# EAGLE design Mainboard (EAGLE 7.7.0)

## Sheet 1 of 5

## Sheet 2 of 5
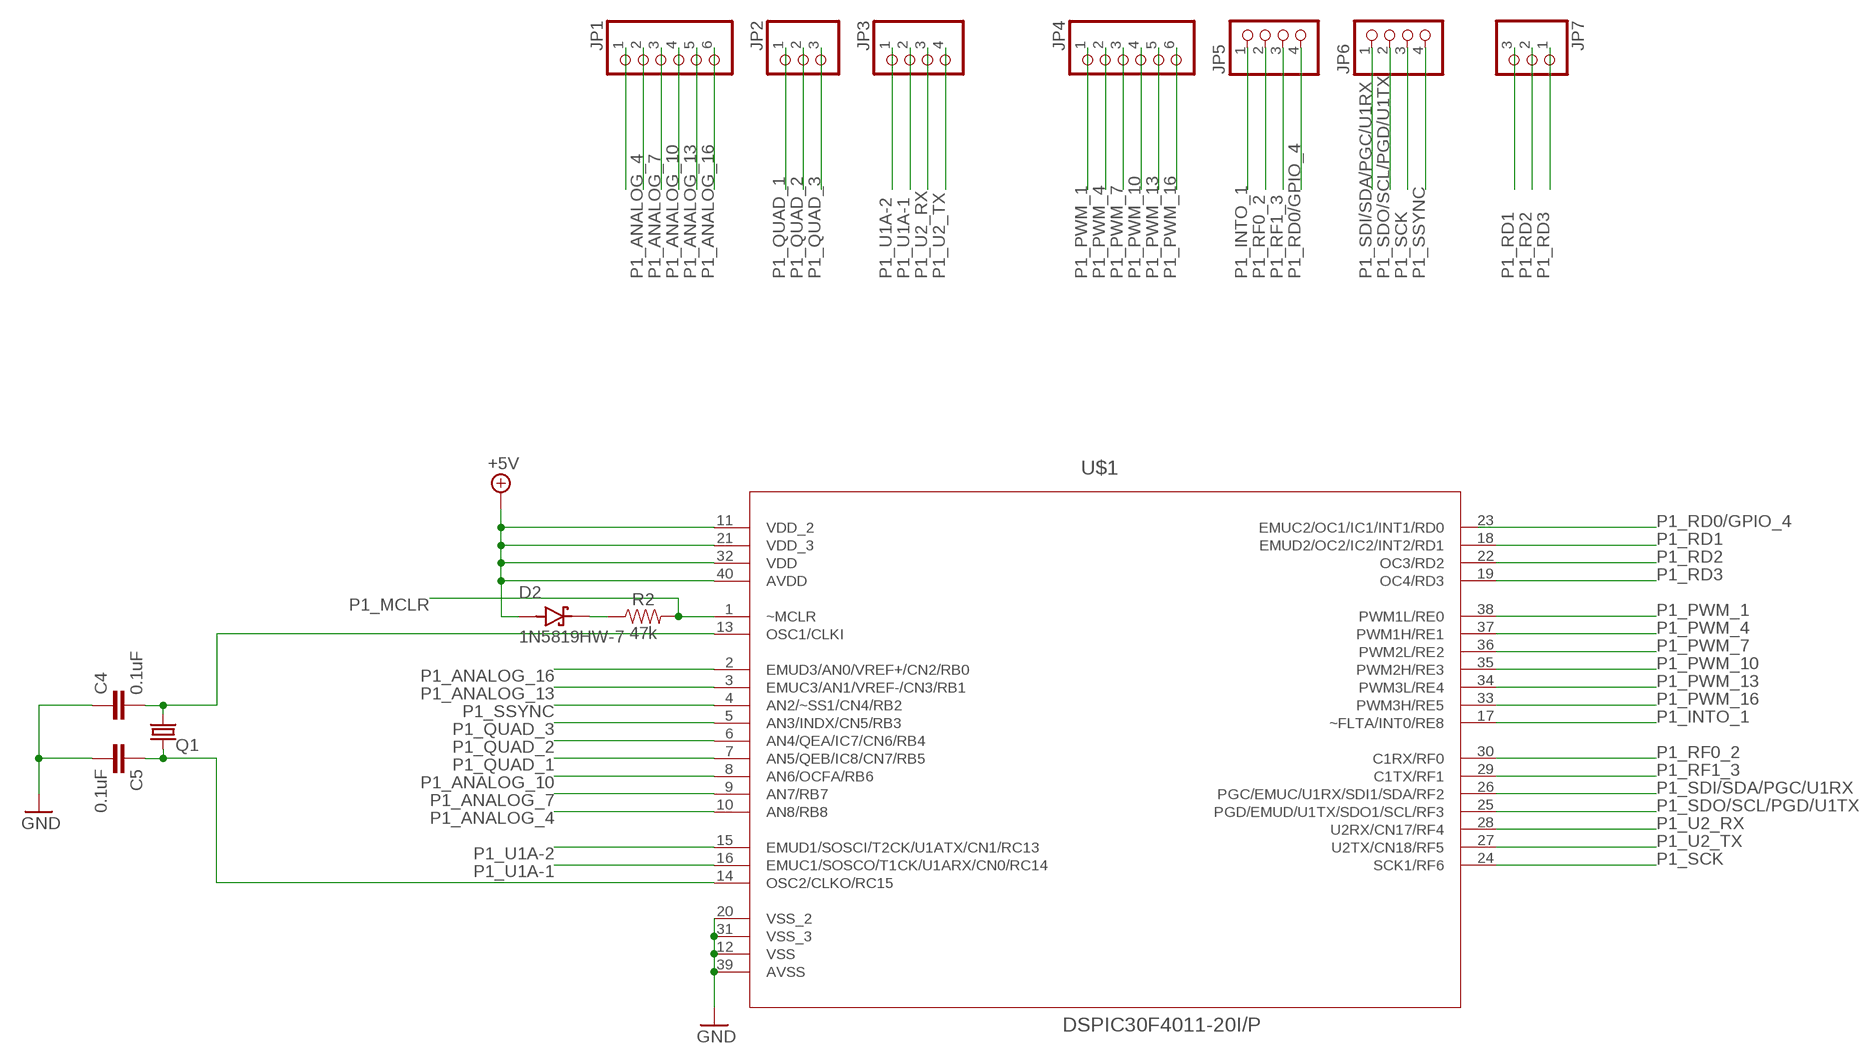
[diagram p0: schematic, sheet 2]

### Parts
C4  0.1uF  0.1UF-0603-100V-10%  [0603]
C5  0.1uF  0.1UF-0603-100V-10%  [0603]
D2  1N5819HW-7  [SOD3715X145N]
JP1  PINHD-1X6  [1X06]
JP2  PINHD-1X3  [1X03]
JP3  PINHD-1X4  [1X04]
JP4  PINHD-1X6  [1X06]
JP5  PINHD-1X4  [1X04]
JP6  PINHD-1X4  [1X04]
JP7  PINHD-1X3  [1X03]
Q1  CRYSTALHC49UP  [HC49UP]
R2  47k  10KOHM-0603-1/10W-1%  [0603]
U$1  DSPIC30F4011-20I/P  [DIP254P1524X635-40]

### Nets
+5V: D2.A U$1.11(VDD_2) U$1.21(VDD_3) U$1.32(VDD) U$1.40(AVDD) ; also sheet 3,4
GND: C4.1 C5.2 U$1.12(VSS) U$1.20(VSS_2) U$1.31(VSS_3) U$1.39(AVSS) ; also sheet 3,4
N$3: C4.2 Q1.2 U$1.13(OSC1/CLKI)
N$4: D2.C(K) R2.1
N$5: C5.1 Q1.1 U$1.14(OSC2/CLKO/RC15)
N$6: JP1.1
P1_ANALOG_4: JP1.2 U$1.10(AN8/RB8)
P1_ANALOG_7: JP1.3 U$1.9(AN7/RB7)
P1_ANALOG_10: JP1.4 U$1.8(AN6/OCFA/RB6)
P1_ANALOG_13: JP1.5 U$1.3(EMUC3/AN1/VREF-/CN3/RB1)
P1_ANALOG_16: JP1.6 U$1.2(EMUD3/AN0/VREF+/CN2/RB0)
P1_INTO_1: JP5.1 U$1.17(~FLTA/INT0/RE8)
P1_MCLR: R2.2 U$1.1(~MCLR)
P1_PWM_1: JP4.1 U$1.38(PWM1L/RE0)
P1_PWM_4: JP4.2 U$1.37(PWM1H/RE1)
P1_PWM_7: JP4.3 U$1.36(PWM2L/RE2)
P1_PWM_10: JP4.4 U$1.35(PWM2H/RE3)
P1_PWM_13: JP4.5 U$1.34(PWM3L/RE4)
P1_PWM_16: JP4.6 U$1.33(PWM3H/RE5)
P1_QUAD_1: JP2.1 U$1.7(AN5/QEB/IC8/CN7/RB5)
P1_QUAD_2: JP2.2 U$1.6(AN4/QEA/IC7/CN6/RB4)
P1_QUAD_3: JP2.3 U$1.5(AN3/INDX/CN5/RB3)
P1_RD0/GPIO_4: JP5.4 U$1.23(EMUC2/OC1/IC1/INT1/RD0)
P1_RD1: JP7.3 U$1.18(EMUD2/OC2/IC2/INT2/RD1)
P1_RD2: JP7.2 U$1.22(OC3/RD2)
P1_RD3: JP7.1 U$1.19(OC4/RD3)
P1_RF0_2: JP5.2 U$1.30(C1RX/RF0)
P1_RF1_3: JP5.3 U$1.29(C1TX/RF1)
P1_SCK: JP6.3 U$1.24(SCK1/RF6)
P1_SDI/SDA/PGC/U1RX: JP6.1 U$1.26(PGC/EMUC/U1RX/SDI1/SDA/RF2)
P1_SDO/SCL/PGD/U1TX: JP6.2 U$1.25(PGD/EMUD/U1TX/SDO1/SCL/RF3)
P1_SSYNC: JP6.4 U$1.4(AN2/~SS1/CN4/RB2)
P1_U1A-1: JP3.2 U$1.16(EMUC1/SOSCO/T1CK/U1ARX/CN0/RC14)
P1_U1A-2: JP3.1 U$1.15(EMUD1/SOSCI/T2CK/U1ATX/CN1/RC13)
P1_U2_RX: JP3.3 U$1.28(U2RX/CN17/RF4)
P1_U2_TX: JP3.4 U$1.27(U2TX/CN18/RF5)

## Sheet 3 of 5
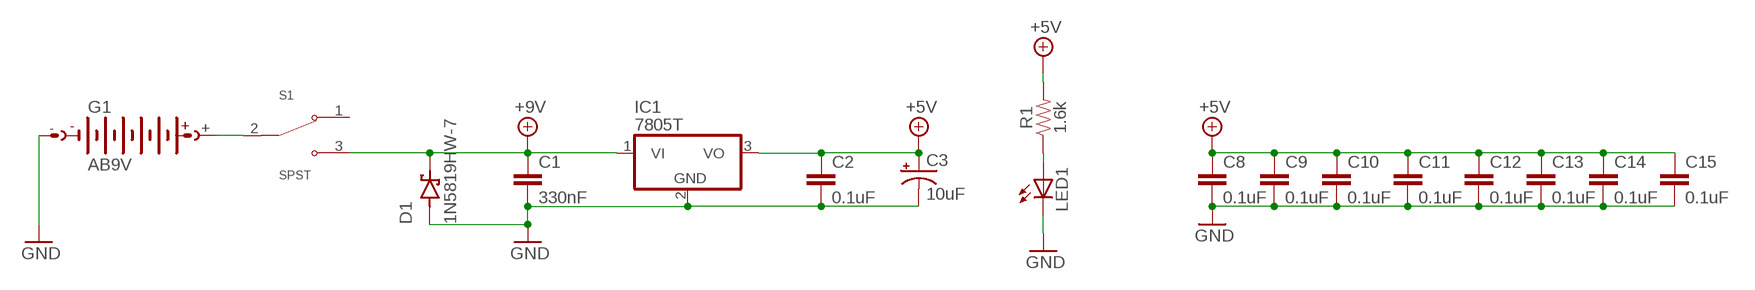
[diagram p1: schematic, sheet 3]

### Parts
C1  330nF  0.1UF-0603-25V-5%  [0603]
C2  0.1uF  0.1UF-0603-25V-5%  [0603]
C3  10uF  10UF-POLAR-RADIAL-2.5MM-25V-20%  [CPOL-RADIAL-2.5MM-5MM]
C8  0.1uF  0.1UF-0603-25V-5%  [0603]
C9  0.1uF  0.1UF-0603-25V-5%  [0603]
C10  0.1uF  0.1UF-0603-25V-5%  [0603]
C11  0.1uF  0.1UF-0603-25V-5%  [0603]
C12  0.1uF  0.1UF-0603-25V-5%  [0603]
C13  0.1uF  0.1UF-0603-25V-5%  [0603]
C14  0.1uF  0.1UF-0603-25V-5%  [0603]
C15  0.1uF  0.1UF-0603-25V-5%  [0603]
D1  1N5819HW-7  [SOD3715X145N]
G1  AB9V  [AB9V]
IC1  7805T  [TO220H]
LED1  LED3MM  [LED3MM]
R1  1.6k  10KOHM-0603-1/10W-1%  [0603]
S1  SPST  [SPST]

### Nets
+5V: C2.1 C3.1(+) C8.1 C9.1 C10.1 C11.1 C12.1 C13.1 C14.1 C15.1 IC1.3(VO) R1.2 ; also sheet 2,4
+9V: C1.1 D1.C(K) IC1.1(VI) S1.3
GND: C1.2 C2.2 C3.2(-) C8.2 C9.2 C10.2 C11.2 C12.2 C13.2 C14.2 C15.2 D1.A G1.- IC1.2(GND) LED1.K(C) ; also sheet 2,4
N$1: G1.+ S1.2
N$2: LED1.A R1.1
Unconnected: S1.1

## Sheet 4 of 5
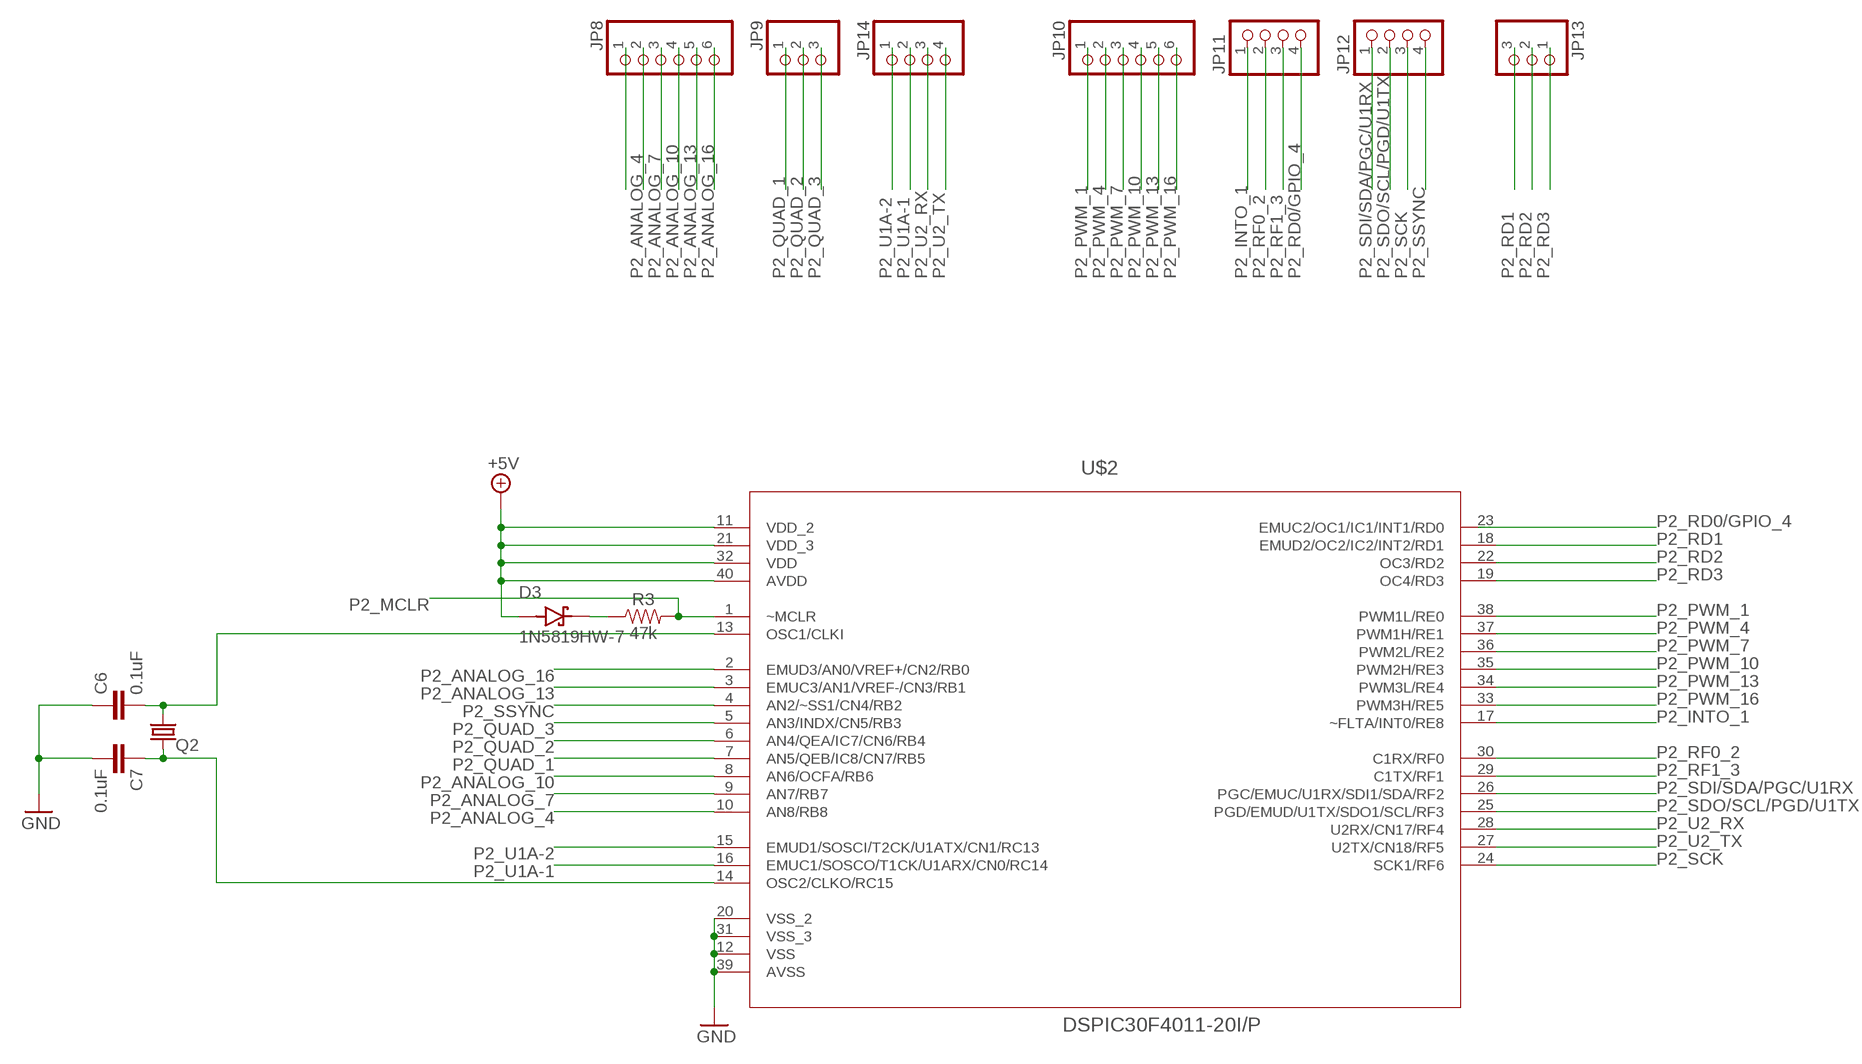
[diagram p2: schematic, sheet 4]

### Parts
C6  0.1uF  0.1UF-0603-100V-10%  [0603]
C7  0.1uF  0.1UF-0603-100V-10%  [0603]
D3  1N5819HW-7  [SOD3715X145N]
JP8  PINHD-1X6  [1X06]
JP9  PINHD-1X3  [1X03]
JP10  PINHD-1X6  [1X06]
JP11  PINHD-1X4  [1X04]
JP12  PINHD-1X4  [1X04]
JP13  PINHD-1X3  [1X03]
JP14  PINHD-1X4  [1X04]
Q2  CRYSTALHC49UP  [HC49UP]
R3  47k  10KOHM-0603-1/10W-1%  [0603]
U$2  DSPIC30F4011-20I/P  [DIP254P1524X635-40]

### Nets
+5V: D3.A U$2.11(VDD_2) U$2.21(VDD_3) U$2.32(VDD) U$2.40(AVDD) ; also sheet 2,3
GND: C6.1 C7.2 U$2.12(VSS) U$2.20(VSS_2) U$2.31(VSS_3) U$2.39(AVSS) ; also sheet 2,3
N$7: D3.C(K) R3.1
N$8: C6.2 Q2.2 U$2.13(OSC1/CLKI)
N$9: C7.1 Q2.1 U$2.14(OSC2/CLKO/RC15)
N$10: JP8.1
P2_ANALOG_4: JP8.2 U$2.10(AN8/RB8)
P2_ANALOG_7: JP8.3 U$2.9(AN7/RB7)
P2_ANALOG_10: JP8.4 U$2.8(AN6/OCFA/RB6)
P2_ANALOG_13: JP8.5 U$2.3(EMUC3/AN1/VREF-/CN3/RB1)
P2_ANALOG_16: JP8.6 U$2.2(EMUD3/AN0/VREF+/CN2/RB0)
P2_INTO_1: JP11.1 U$2.17(~FLTA/INT0/RE8)
P2_MCLR: R3.2 U$2.1(~MCLR)
P2_PWM_1: JP10.1 U$2.38(PWM1L/RE0)
P2_PWM_4: JP10.2 U$2.37(PWM1H/RE1)
P2_PWM_7: JP10.3 U$2.36(PWM2L/RE2)
P2_PWM_10: JP10.4 U$2.35(PWM2H/RE3)
P2_PWM_13: JP10.5 U$2.34(PWM3L/RE4)
P2_PWM_16: JP10.6 U$2.33(PWM3H/RE5)
P2_QUAD_1: JP9.1 U$2.7(AN5/QEB/IC8/CN7/RB5)
P2_QUAD_2: JP9.2 U$2.6(AN4/QEA/IC7/CN6/RB4)
P2_QUAD_3: JP9.3 U$2.5(AN3/INDX/CN5/RB3)
P2_RD0/GPIO_4: JP11.4 U$2.23(EMUC2/OC1/IC1/INT1/RD0)
P2_RD1: JP13.3 U$2.18(EMUD2/OC2/IC2/INT2/RD1)
P2_RD2: JP13.2 U$2.22(OC3/RD2)
P2_RD3: JP13.1 U$2.19(OC4/RD3)
P2_RF0_2: JP11.2 U$2.30(C1RX/RF0)
P2_RF1_3: JP11.3 U$2.29(C1TX/RF1)
P2_SCK: JP12.3 U$2.24(SCK1/RF6)
P2_SDI/SDA/PGC/U1RX: JP12.1 U$2.26(PGC/EMUC/U1RX/SDI1/SDA/RF2)
P2_SDO/SCL/PGD/U1TX: JP12.2 U$2.25(PGD/EMUD/U1TX/SDO1/SCL/RF3)
P2_SSYNC: JP12.4 U$2.4(AN2/~SS1/CN4/RB2)
P2_U1A-1: JP14.2 U$2.16(EMUC1/SOSCO/T1CK/U1ARX/CN0/RC14)
P2_U1A-2: JP14.1 U$2.15(EMUD1/SOSCI/T2CK/U1ATX/CN1/RC13)
P2_U2_RX: JP14.3 U$2.28(U2RX/CN17/RF4)
P2_U2_TX: JP14.4 U$2.27(U2TX/CN18/RF5)

## Sheet 5 of 5
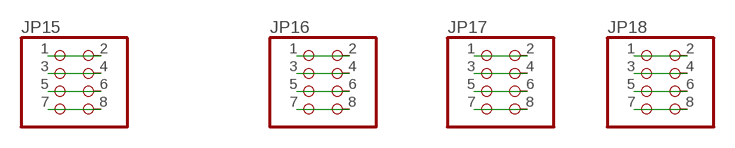
[diagram p3: schematic, sheet 5]

### Parts
JP15  PINHD-2X4  [2X04]
JP16  PINHD-2X4  [2X04]
JP17  PINHD-2X4  [2X04]
JP18  PINHD-2X4  [2X04]

### Nets
N$15: JP15.1 JP15.2
N$16: JP15.3 JP15.4
N$17: JP15.5 JP15.6
N$18: JP15.7 JP15.8
N$19: JP16.1 JP16.2
N$20: JP16.3 JP16.4
N$21: JP16.5 JP16.6
N$22: JP16.7 JP16.8
N$23: JP17.1 JP17.2
N$24: JP17.3 JP17.4
N$25: JP17.5 JP17.6
N$26: JP17.7 JP17.8
N$27: JP18.1 JP18.2
N$28: JP18.3 JP18.4
N$29: JP18.5 JP18.6
N$30: JP18.7 JP18.8

## Library data of the parts
C1 = SparkFun-Capacitors:0.1UF: 0.1µF ceramic capacitors A capacitor is a passive two-terminal electrical component used to store electrical energy temporarily in an electric field.; PROD_ID: CAP-08604; VALUE: 0.1uF
C2 C8-C15 = SparkFun-Capacitors:0.1UF: 0.1µF ceramic capacitors A capacitor is a passive two-terminal electrical component used to store electrical energy temporarily in an electric field.; PROD_ID: CAP-08604
C3 = SparkFun-Capacitors:10UF-POLAR: 10.0µF polarized capacitors A capacitor is a passive two-terminal electrical component used to store electrical energy temporarily in an electric field.; PROD_ID: CAP-08440
C4 C5 = SparkFun-Capacitors:0.1UF: 0.1µF ceramic capacitors A capacitor is a passive two-terminal electrical component used to store electrical energy temporarily in an electric field.; PROD_ID: CAP-08390
C6 C7 = SparkFun-Capacitors@1:0.1UF: 0.1µF ceramic capacitors A capacitor is a passive two-terminal electrical component used to store electrical energy temporarily in an electric field.; PROD_ID: CAP-08390
D1-D3 = 1N5819HW-7:1N5819HW-7: 1N5819HW Series 40 V 1 A Surface Mount Schottky Barrier Rectifier - SOD-123 Check availability <https://pricing.snapeda.com/parts/1N5819HW-7/Diodes%20Inc./view-part?ref=eda>; AVAILABILITY: In Stock; DESCRIPTION: Diode Schottky 40 V 1A Surface Mount SOD-123; MF: Diodes Inc.; MP: 1N5819HW-7; PACKAGE: SOD-123 Fairchild Semiconductor; PRICE: None
G1 = battery:AB9V: 9-V BATTERY CLIP
IC1 = adafruit:78*: Positive VOLTAGE REGULATOR Added bigger pads to the TO-92 package
JP1 JP4 JP8 JP10 = adafruit:PINHD-1X6: PIN HEADER
JP2 JP7 JP9 JP13 = adafruit:PINHD-1X3: PIN HEADER
JP3 JP5 JP6 = pinhead:PINHD-1X4: PIN HEADER
JP11 JP12 JP14 = pinhead@1:PINHD-1X4: PIN HEADER
JP15-JP18 = pinhead@2:PINHD-2X4: PIN HEADER
LED1 = adafruit:LED: LED OSRAM: - CHIPLED LG R971, LG N971, LY N971, LG Q971, LY Q971, LO R971, LY R971 LH N974, LH R974 LS Q976, LO Q976, LY Q976 LO Q996 - Hyper CHIPLED LW Q18S LB Q993, LB Q99A, LB R99A - SideLED LS A670, LO A670, LY A670, LG A670, LP A670 LB A673, LV A673, LT A673, LW A673 LH A674 LY A675 LS A676, LA A676, LO A676, LY A676, LW A676 LS A679, LY A679, LG A679 - Hyper Micro SIDELED® LS Y876, LA Y876, LO Y876, LY Y876 LT Y87S - SmartLED LW L88C, LW L88S LB L89C, LB L89S, LG L890 LS L89K, LO L89K, LY L89K LS L896, LA L896, LO L896, LY L896 - TOPLED LS T670, LO T670, LY T670, LG T670, LP T670 LSG T670, LSP T670, LSY T670, LOP T670, LYG T670 LG T671, LOG T671, LSG T671 LB T673, LV T673, LT T673, LW T673 LH T674 LS T676, LA T676, LO T676, LY T676, LB T676, LH T676, LSB T676, LW T676 LB T67C, LV T67C, LT T67C, LS T67K, LO T67K, LY T67K, LW E67C LS E67B, LA E67B, LO E67B, LY E67B, LB E67C, LV E67C, LT E67C LW T67C LS T679, LY T679, LG T679 LS T770, LO T770, LY T770, LG T770, LP T770 LB T773, LV T773, LT T773, LW T773 LH T774 LS E675, LA E675, LY E675, LS T675 LS T776, LA T776, LO T776, LY T776, LB T776 LHGB T686 LT T68C, LB T68C - Hyper Mini TOPLED® LB M676 - Mini TOPLED Santana® LG M470 LS M47K, LO M47K, LY M47K Source: http://www.osram.convergy.de/
Q1 Q2 = adafruit:CRYSTAL: CRYSTAL; OC_FARNELL: unknown; OC_NEWARK: unknown
R1 R2 = SparkFun-Resistors:10KOHM: 10kΩ resistor A resistor is a passive two-terminal electrical component that implements electrical resistance as a circuit element. Resistors act to reduce current flow, and, at the same time, act to lower voltage levels within circuits. - Wikipedia; PROD_ID: RES-00824; VALUE: 10k
R3 = SparkFun-Resistors@1:10KOHM: 10kΩ resistor A resistor is a passive two-terminal electrical component that implements electrical resistance as a circuit element. Resistors act to reduce current flow, and, at the same time, act to lower voltage levels within circuits. - Wikipedia; PROD_ID: RES-00824; VALUE: 10k
S1 = Rodney Library:SPST: Toggle Switch SPDT Through Hole Check availability <https://pricing.snapeda.com/parts/100SP1T1B4M2QE/E-Switch/view-part?ref=eda>; AVAILABILITY: In Stock; DESCRIPTION: Toggle Switch SPDT Through Hole; MF: E-Switch; MP: 100SP1T1B4M2QE; PACKAGE: None; PRICE: None; PURCHASE-URL: https://pricing.snapeda.com/search/part/100SP1T1B4M2QE/?ref=eda
U$1 U$2 = MODEST_MOUSE_LIBRARY:DSPIC30F4011-20I/P: DSPIC30F4011-20I/P

## Board
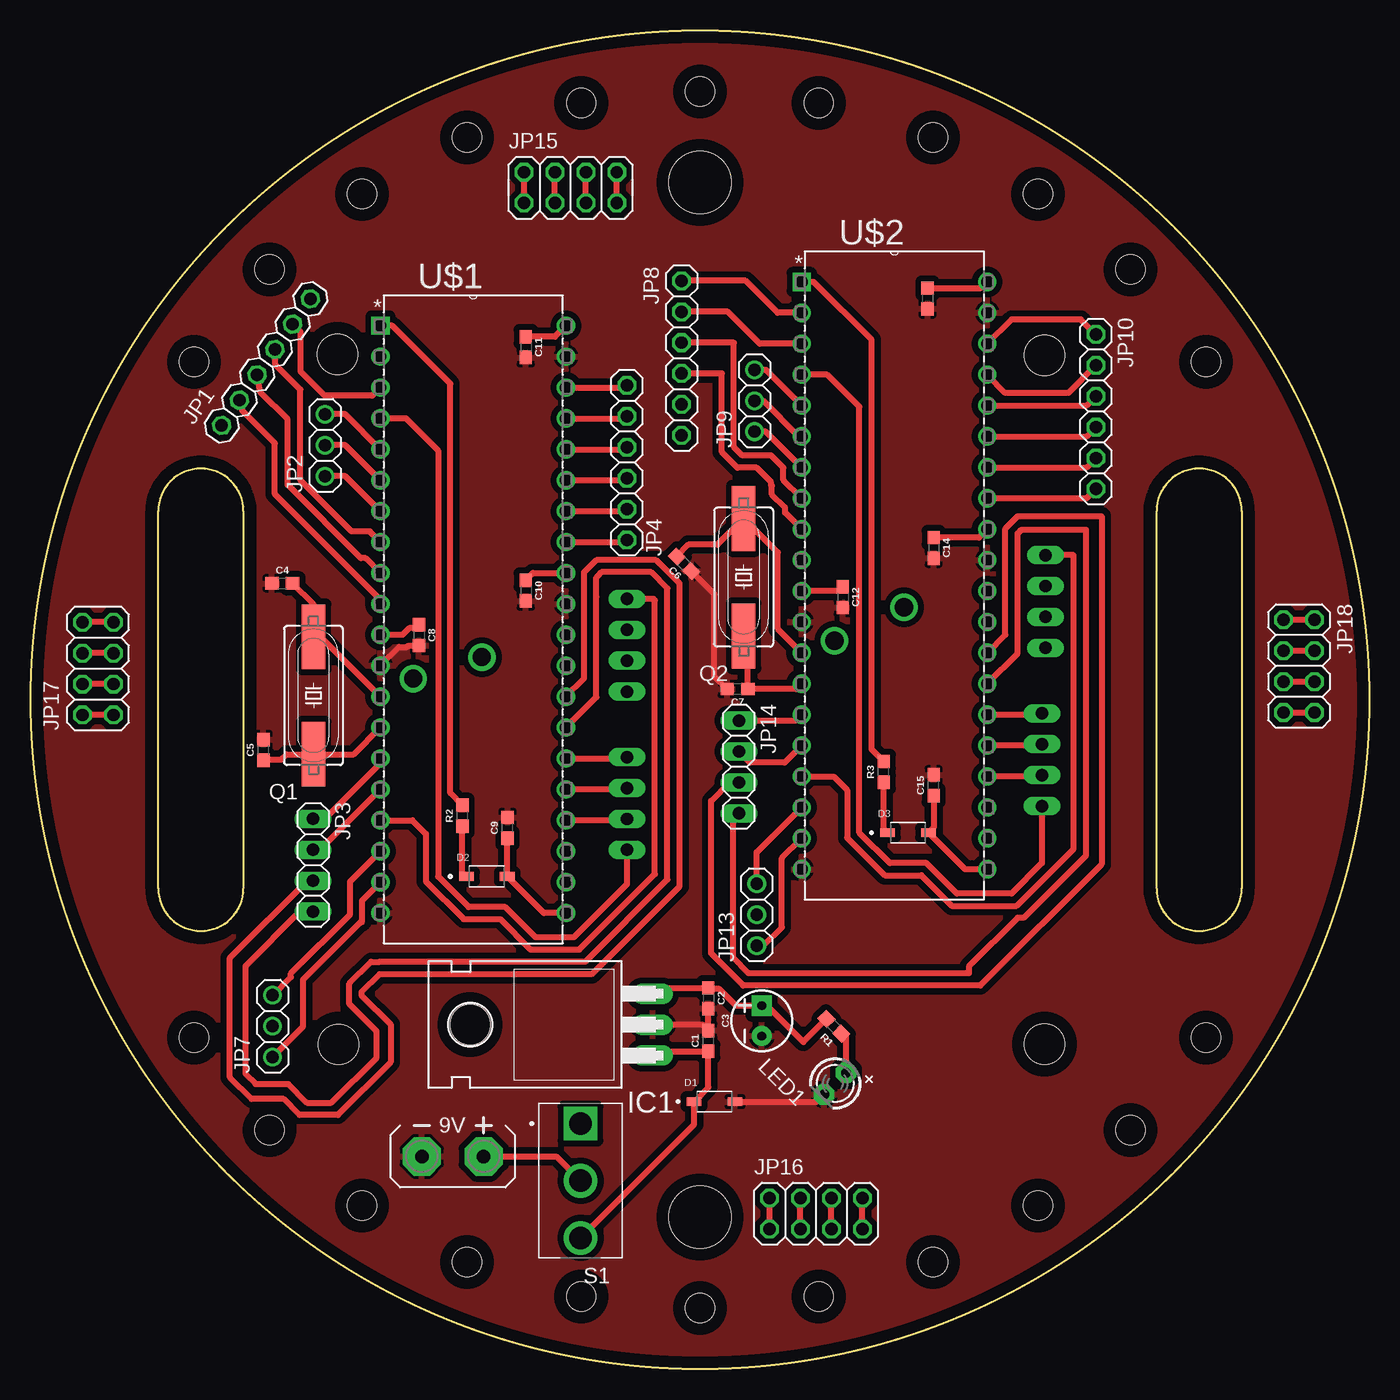
[diagram p4: board, top side]
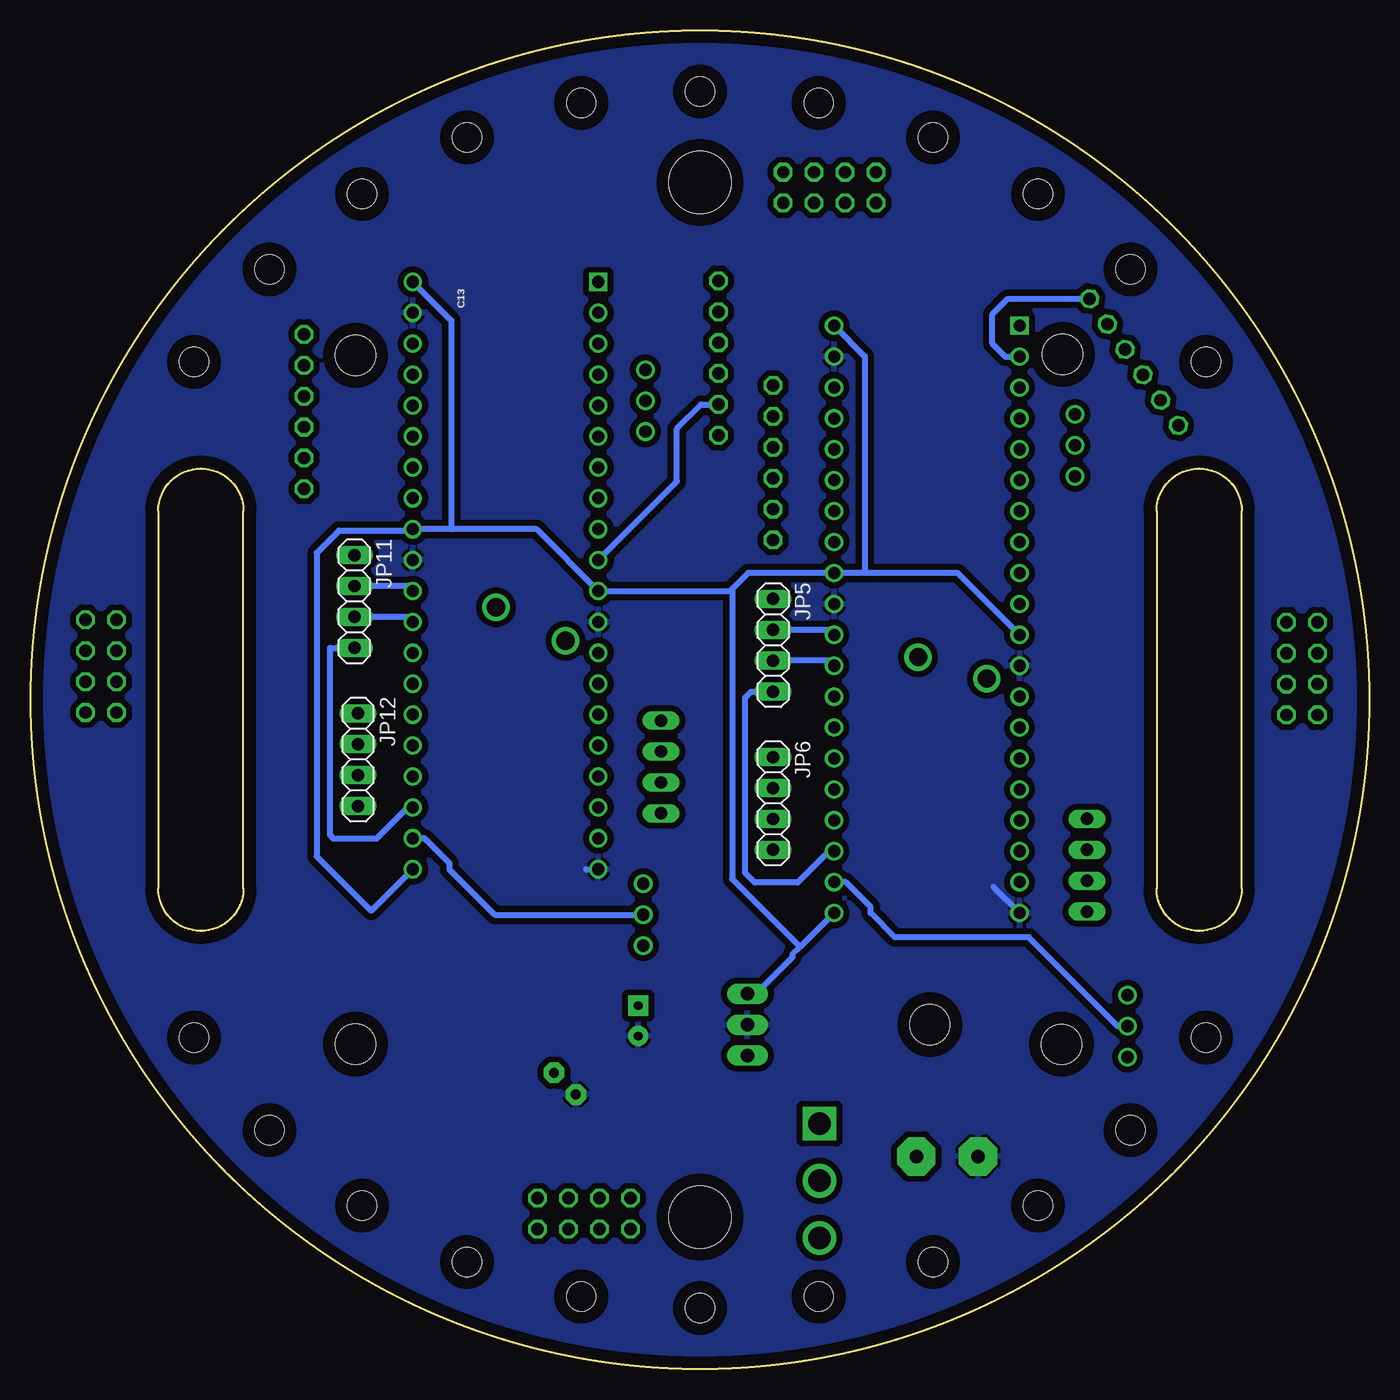
[diagram p5: board, bottom side, seen from below]

Size 110 x 110 mm. Coordinates in mm from the lower left corner, seen from the top.
Outline: 92.5,39.5 arc180 99.5,39.5 99.5,70.5 arc180 92.5,70.5 92.5,39.5
Outline: 10.5,39.5 arc180 17.5,39.5 17.5,70.5 arc180 10.5,70.5 10.5,39.5
Outline: circle at 55,55 radius 55
Copper layers (1*16): Top 0.035mm / dielectric 1.5mm / Bottom 0.035mm
Design rules "UWE_Router_Std_SS&DS": minimum track width 0.5mm, minimum drill 0.7mm, track to track 0.5mm, track to pad 0.5mm, pad to pad 0.5mm, via to via 0.5mm, smd to smd 0.5mm, copper to edge 1mm, drill to drill 0.2mm, minimum pad ring 10mil, minimum via ring 8mil, stop-mask expansion 4mil, vias tented up to drill 0mil, thermal gap 0.25mm
Holes 2.4 mm at 35.87,8.81 35.87,101.19 74.13,8.81 19.64,90.36 13.43,27.22 90.36,90.36 19.64,19.64 55,105 90.36,19.64 55,5 64.75,5.96 82.78,13.43 45.25,5.96 74.13,101.19 27.22,13.43 96.57,27.22 13.43,82.78 27.22,96.57 64.75,104.04 45.25,104.04 82.78,96.57 96.57,82.78
Holes 5.1 mm at 55,97.5 55,12.5
Holes 3.3 mm at 83.28,26.72 25.21,83.4 83.28,83.28 25.3,26.69

### Footprints (pad centres in the part's own frame; a part is rotated, then mirrored left to right if it is on the bottom)
0603 = smd 1.1 x 1: 1 -0.85,0; 2 0.85,0
CPOL-RADIAL-2.5MM-5MM = drill 0.7 pad 1.651 square: 1 1.25,0 | drill 0.7 pad 1.651: 2 -1.25,0
SOD3715X145N = smd 1.21 x 0.73: A 1.68,0; C -1.68,0
AB9V = drill 1.118 pad 3.15 octagon: + 0,2.54; - 0,-2.54
TO220H = drill 1.118 long: 1 -2.54,-10.16; 2 0,-10.16; 3 2.54,-10.16 | hole 3.302: 0,4.826
1X06 = drill 1.016 octagon: 1 -6.35,0; 2 -3.81,0; 3 -1.27,0; 4 1.27,0; 5 3.81,0; 6 6.35,0
1X03 = drill 1.016: 1 -2.54,0; 2 0,0; 3 2.54,0
1X04 = drill 1.016 long: 1 -3.81,0; 2 -1.27,0; 3 1.27,0; 4 3.81,0
2X04 = drill 1.016 octagon: 1 -3.81,-1.27; 2 -3.81,1.27; 3 -1.27,-1.27; 4 -1.27,1.27; 5 1.27,-1.27; 6 1.27,1.27; 7 3.81,-1.27; 8 3.81,1.27
LED3MM = drill 0.813 pad 1.676 octagon: A -1.27,0; K 1.27,0
HC49UP = smd 5.334 x 1.93: 1 -4.826,0; 2 4.826,0
SPST = drill 1.85 square: 1 0,4.7 | drill 1.85: 2 0,0; 3 0,-4.7
DIP254P1524X635-40 = drill 0.991 square: 1 -15.24,48.26 | drill 0.991: 2 -15.24,45.72; 3 -15.24,43.18; 4 -15.24,40.64; 5 -15.24,38.1; 6 -15.24,35.56; 7 -15.24,33.02; 8 -15.24,30.48; 9 -15.24,27.94; 10 -15.24,25.4; 11 -15.24,22.86; 12 -15.24,20.32; 13 -15.24,17.78; 14 -15.24,15.24; 15 -15.24,12.7; 16 -15.24,10.16; 17 -15.24,7.62; 18 -15.24,5.08; 19 -15.24,2.54; 20 -15.24,0; 21 0,0; 22 0,2.54; 23 0,5.08; 24 0,7.62; 25 0,10.16; 26 0,12.7; 27 0,15.24; 28 0,17.78; 29 0,20.32; 30 0,22.86; 31 0,25.4; 32 0,27.94; 33 0,30.48; 34 0,33.02; 35 0,35.56; 36 0,38.1; 37 0,40.64; 38 0,43.18; 39 0,45.72; 40 0,48.26

### Placement (x,y rotation side)
C1  55.69,26.97 90 top
C2  55.69,30.47 270 top
C3  60.07,28.62 90 top
C4  20.69,64.56 0 top
C5  19.14,50.87 90 top
C6  53.69,66.17 135 top
C7  58.09,55.87 180 top
C8  31.91,60.31 270 top
C9  39.19,44.47 90 top
C10  40.69,63.97 270 top
C11  40.69,83.97 270 top
C12  66.73,63.43 270 top
C13  73.69,87.97 270 top
C14  74.19,67.47 270 top
C15  74.19,47.97 90 top
D1  56.19,21.97 0 top
D2  37.49,40.47 0 top
D3  72.09,44.07 0 top
G1  34.69,17.47 270 top
IC1  40.95,28.3 90 top
JP1  19.35,82.75 55 top
JP2  24.2,75.91 90 top
JP3  23.23,41.4 270 top
JP4  48.99,74.47 270 top
JP5  48.99,59.47 270 bottom
JP6  48.99,46.47 270 bottom
JP7  19.89,28.17 90 top
JP8  53.49,83.07 90 top
JP9  59.49,79.57 90 top
JP10  87.52,78.67 270 top
JP11  83.39,63.07 270 bottom
JP12  83.09,50.07 270 bottom
JP13  59.66,37.33 90 top
JP14  58.19,49.47 270 top
JP15  44.36,97.08 0 top
JP16  64.52,12.78 0 top
JP17  5.55,57.56 90 top
JP18  104.2,57.76 270 top
LED1  66.1,23.46 225 top
Q1  23.25,55.35 90 top
Q2  58.59,65.07 90 top
R1  65.99,28.17 135 top
R2  35.49,45.47 90 top
R3  70.09,49.07 90 top
S1  45.19,15.47 0 top
U$1  43.99,37.47 0 top
U$2  78.59,41.07 0 top

### Tracks (layer width: path | path; a pad name or v marks a point on that pad's centre or on a via)
+5V
  Top 0.5: IC1.3 51.6,31.33 C2.1 55.79,31.23 56.59,31.23 57.95,29.87 C3.1 60.5,29.87 63.49,26.87 R1.2 | U$1.21 42.17,37.48 D2.A 39.17,43.61 C9.1 | U$2.21 76.77,41.08 D3.A 74.19,44.5 C15.1 | C8.1 31.57,60.89 31.11,60.89 30.56,60.34 U$1.11 | C12.1 66.46,63.94 U$2.11 | U$2.32 77.9,68.33 C14.1 | C13.1 78.08,88.83 U$2.40 | U$1.40 43.08,84.83 C11.1 | C10.1 41.28,65.42 U$1.32
  Bottom 0.5: IC1.3 50.41,30.84 47.41,33.84 47.41,34.05 46.78,34.69 | 46.78,34.69 U$1.21 | U$1.11 33.83,65.42 41.46,65.42 | 41.46,65.42 U$1.32 51.05,65.42 52.36,64.11 | 52.36,64.11 52.49,63.98 52.53,63.94 U$2.11 68.43,69.02 75.42,69.02 | 52.36,64.11 52.36,40.27 46.78,34.69 | U$2.21 82.01,37.65 86.49,42.13 86.49,67.08 84.65,68.92 78.69,68.92 U$2.32 75.42,69.02 | U$1.40 41.46,83.21 41.46,65.42 | U$2.40 75.42,86.17 75.42,69.02
+9V
  Top 0.5: IC1.1 51.48,26.13 C1.1 55.69,23.16 D1.C 54.51,20.1 S1.3
GND
  Top 0.5: C2.2 C1.2 55.21,28.3 IC1.2 | LED1.K 64.61,21.98 D1.A | C7.2 56.19,56.93 56.19,63.68 C6.1 | U$1.12 30.29,59.34 30.97,59.34 31.09,59.46 C8.2
  Bottom 0.5: 30.9,39.63 U$1.20 | 64.38,41.08 U$2.20
  pour Top: -14.28,80.17 -14.28,27.19 20.98,-8.07 85.04,-8.07 116.18,23.07 116.18,81.71 80.07,117.82 23.26,117.82
  pour Bottom: -13.81,27.53 21.78,-8.07 85.84,-8.07 116.98,23.07 116.98,81.71 80.87,117.82 23.07,117.82 -13.78,80.98
N$1
  Top 0.5: G1.+ 43.19,17.48 S1.2
N$2
  Top 0.5: LED1.A 66.99,27.51 R1.1
N$3
  Top 0.5: U$1.13 23.83,60.17 Q1.2 23.25,62.85 C4.2
N$4
  Top 0.5: D2.C 35.49,40.8 R2.1
N$5
  Top 0.5: U$1.14 26.56,50.52 Q1.1 21.04,50.52 20.59,50.08 19.19,50.08 C5.1
N$7
  Top 0.5: D3.C 70.09,44.4 R3.1
N$8
  Top 0.5: U$2.13 61.39,60.82 61.39,67.1 Q2.2 56.42,67.74 54.05,67.74 C6.2
N$9
  Top 0.5: U$2.14 62.91,55.88 C7.1 58.94,59.9 | 58.94,59.9 Q2.1 58.94,59.9
N$11  (via drill 1.5)
  other vias: 66.05,59.84
N$12  (via drill 1.5)
  other vias: 71.75,62.6
N$13  (via drill 1.5)
  other vias: 31.44,56.74
N$14  (via drill 1.5)
  other vias: 37.08,58.5
N$15
  Top 0.5: JP15.1 JP15.2
N$16
  Top 0.5: JP15.3 JP15.4
N$17
  Top 0.5: JP15.5 JP15.6
N$18
  Top 0.5: JP15.7 JP15.8
N$19
  Top 0.5: JP16.1 JP16.2
N$20
  Top 0.5: JP16.3 JP16.4
N$21
  Top 0.5: JP16.5 JP16.6
N$22
  Top 0.5: JP16.7 JP16.8
N$23
  Top 0.5: JP17.1 JP17.2
N$24
  Top 0.5: JP17.3 JP17.4
N$25
  Top 0.5: JP17.5 JP17.6
N$26
  Top 0.5: JP17.7 JP17.8
N$27
  Top 0.5: JP18.1 JP18.2
N$28
  Top 0.5: JP18.3 JP18.4
N$29
  Top 0.5: JP18.5 JP18.6
N$30
  Top 0.5: JP18.7 JP18.8
P1_ANALOG_4
  Top 0.5: U$1.10 28.57,63.05 28.57,63.41 20.09,71.89 20.09,76.08 17.43,78.74 JP1.2
P1_ANALOG_7
  Top 0.5: U$1.9 27.53,66.64 27.15,66.64 21.12,72.66 21.12,78.04 18.89,80.28 JP1.3
P1_ANALOG_10
  Top 0.5: U$1.8 27.88,68.83 26.39,68.83 22.17,73.05 22.17,80.5 20.08,82.59 JP1.4
P1_ANALOG_13
  Top 0.5: U$1.3 28.07,79.98 24.19,79.98 22.19,81.98 22.19,85.21 JP1.5
P1_ANALOG_16
  Bottom 0.5: JP1.6 29.72,87.95 30.99,86.68 30.99,84.28 29.91,83.2 U$1.2
P1_INTO_1
  Top 0.5: U$1.17 31.37,45.1 32.49,43.98 32.49,40.06 35.58,36.98 38.58,36.98 41.08,34.48 45.09,34.48 51.3,40.68 51.3,63.17 51.18,63.29 JP5.1
P1_MCLR
  Top 0.5: R2.2 34.49,47.33 34.49,80.98 29.73,85.74 U$1.1
P1_PWM_1
  Top 0.5: U$1.38 48.82,80.66 JP4.1
P1_PWM_4
  Top 0.5: U$1.37 48.82,78.12 JP4.2
P1_PWM_7
  Top 0.5: U$1.36 48.82,75.58 JP4.3
P1_PWM_10
  Top 0.5: U$1.35 48.82,73.04 JP4.4
P1_PWM_13
  Top 0.5: U$1.34 48.82,70.5 JP4.5
P1_PWM_16
  Top 0.5: U$1.33 48.82,67.96 JP4.6
P1_QUAD_1
  Top 0.5: U$1.7 25.87,73.37 JP2.1
P1_QUAD_2
  Top 0.5: JP2.2 25.86,75.91 28.74,73.04 U$1.6
P1_QUAD_3
  Top 0.5: U$1.5 25.87,78.45 JP2.3
P1_RD0/GPIO_4
  Bottom 0.5: U$1.23 44.41,42.56 46.99,39.98 50.49,39.98 51.3,40.79 51.3,55.17 50.8,55.67 JP5.4
P1_RD1
  Top 0.5: JP7.3 21.39,32.21 21.39,32.51 26.25,37.37 26.25,40.06 U$1.18
P1_RD2
  Bottom 0.5: JP7.2 20.69,28.18 27.99,35.48 38.99,35.48 40.99,37.48 40.99,37.98 43.03,40.02 U$1.22
P1_RD3
  Top 0.5: JP7.1 22.41,28.15 22.41,32.02 27.09,36.71 27.21,36.71 27.25,36.75 27.25,38.5 28.75,40 U$1.19
P1_RF0_2
  Bottom 0.5: U$1.30 44.4,60.75 JP5.2
P1_RF1_3
  Bottom 0.5: U$1.29 44.4,58.21 JP5.3
P1_SCK
  Top 0.5: JP6.3 48.88,45.1 U$1.24
P1_SDI/SDA/PGC/U1RX
  Top 0.5: U$1.26 48.88,50.18 JP6.1
P1_SDO/SCL/PGD/U1TX
  Top 0.5: JP6.2 48.88,47.64 U$1.25
P1_SSYNC
  Top 0.5: JP6.4 48.99,39.83 44.64,35.48 41.49,35.48 38.99,37.98 35.99,37.98 33.49,40.48 33.49,75.48 30.85,78.12 U$1.4
P1_U1A-1
  Top 0.5: U$1.16 23.86,42.75 23.22,42.75 JP3.2
P1_U1A-2
  Top 0.5: JP3.1 23.24,45.23 24.21,45.23 28.75,49.78 U$1.15
P1_U2_RX
  Top 0.5: U$1.28 45.49,56.76 45.49,65.48 46.49,66.48 51.4,66.48 53.32,64.56 53.32,39.67 46.1,32.45 28.66,32.45 27.19,30.98 27.19,30.72 29.58,28.33 29.58,25.22 25.24,20.89 22.1,20.89 20.79,22.19 18.18,22.19 16.39,23.98 16.39,33.79 22.73,40.13 JP3.3
P1_U2_TX
  Top 0.5: U$1.27 46.49,55.22 46.49,63.48 46.49,65.06 46.7,65.27 46.9,65.48 50.99,65.48 52.32,64.15 52.32,40.22 45.58,33.48 28.69,33.48 27.99,33.48 26.19,31.68 26.19,30 28.43,27.76 28.43,25.59 24.73,21.89 22.72,21.89 21.18,23.42 18.49,23.42 17.65,24.26 17.65,33.11 22.13,37.59 JP3.4
P2_ANALOG_4
  Bottom 0.5: U$2.10 56.89,72.94 56.89,77.28 54.9,79.27 JP8.2
P2_ANALOG_7
  Top 0.5: JP8.3 56.79,81.81 56.79,75.36 58.08,74.08 59.65,74.08 60.85,72.88 60.85,72.64 60.9,72.59 60.9,71.88 61.99,70.79 61.99,70.38 U$2.9
P2_ANALOG_10
  Top 0.5: JP8.4 57.79,84.35 57.79,75.78 58.49,75.08 60.85,75.08 61.85,74.08 61.85,73.05 U$2.8
P2_ANALOG_13
  Top 0.5: U$2.3 59.91,84.26 57.28,86.89 JP8.5
P2_ANALOG_16
  Top 0.5: U$2.2 61.37,86.8 58.74,89.43 JP8.6
P2_INTO_1
  Top 0.5: U$2.17 65.97,48.7 67.09,47.58 67.09,43.66 70.18,40.58 73.18,40.58 75.68,38.08 81,38.08 85.69,42.76 85.69,66.89 JP11.1
P2_MCLR
  Top 0.5: R3.2 69.09,50.93 69.09,84.58 64.33,89.34 U$2.1
P2_PWM_1
  Top 0.5: U$2.38 80.59,86.26 86.29,86.26 JP10.1
P2_PWM_4
  Top 0.5: U$2.37 80.09,80.22 85.26,80.22 JP10.2
P2_PWM_7
  Top 0.5: U$2.36 86.76,79.18 JP10.3
P2_PWM_10
  Top 0.5: U$2.35 86.76,76.64 JP10.4
P2_PWM_13
  Top 0.5: U$2.34 86.76,74.1 JP10.5
P2_PWM_16
  Top 0.5: U$2.33 86.76,71.56 JP10.6
P2_QUAD_1
  Top 0.5: U$2.7 60.41,77.04 JP9.1
P2_QUAD_2
  Top 0.5: U$2.6 63.13,76.64 60.19,79.58 JP9.2
P2_QUAD_3
  Top 0.5: JP9.3 60.41,82.12 U$2.5
P2_RD0/GPIO_4
  Bottom 0.5: U$2.23 79.01,46.16 81.59,43.58 85.09,43.58 85.39,43.88 85.39,59.27 JP11.4
P2_RD1
  Top 0.5: U$2.18 59.66,42.47 JP13.3
P2_RD2
  Bottom 0.5: U$2.22 77.63,43.62 75.59,41.58 75.59,41.08 71.85,37.34 JP13.2
P2_RD3
  Top 0.5: JP13.1 60.21,34.8 61.72,36.31 61.72,41.99 U$2.19
P2_RF0_2
  Bottom 0.5: U$2.30 79,64.35 JP11.2
P2_RF1_3
  Bottom 0.5: U$2.29 79,61.81 JP11.3
P2_SCK
  Top 0.5: JP12.3 82.98,48.7 U$2.24
P2_SDI/SDA/PGC/U1RX
  Top 0.5: U$2.26 82.98,53.78 JP12.1
P2_SDO/SCL/PGD/U1TX
  Top 0.5: JP12.2 82.98,51.24 U$2.25
P2_SSYNC
  Top 0.5: JP12.4 83.09,41.58 80.59,39.08 76.09,39.08 73.59,41.58 70.59,41.58 68.09,44.08 68.09,79.08 65.45,81.72 U$2.4
P2_U1A-1
  Top 0.5: U$2.16 61.96,49.85 59.09,49.85 JP14.2
P2_U1A-2
  Top 0.5: JP14.1 62.86,53.29 U$2.15
P2_U2_RX
  Top 0.5: U$2.28 80.09,60.36 80.09,69.08 81.09,70.08 87.99,70.08 87.99,41.48 78.04,31.52 58.55,31.52 55.91,34.16 55.91,46.69 57.42,48.21 JP14.3
P2_U2_TX
  Top 0.5: U$2.27 81.09,58.82 81.09,67.08 81.09,68.66 81.3,68.87 81.4,68.98 86.69,68.98 86.69,42.18 81.59,37.08 81.09,37.08 77.09,33.08 77.09,32.52 58.96,32.52 57.72,33.77 57.72,45.19 JP14.4